# EAGLE design example (EAGLE 7.2.0)
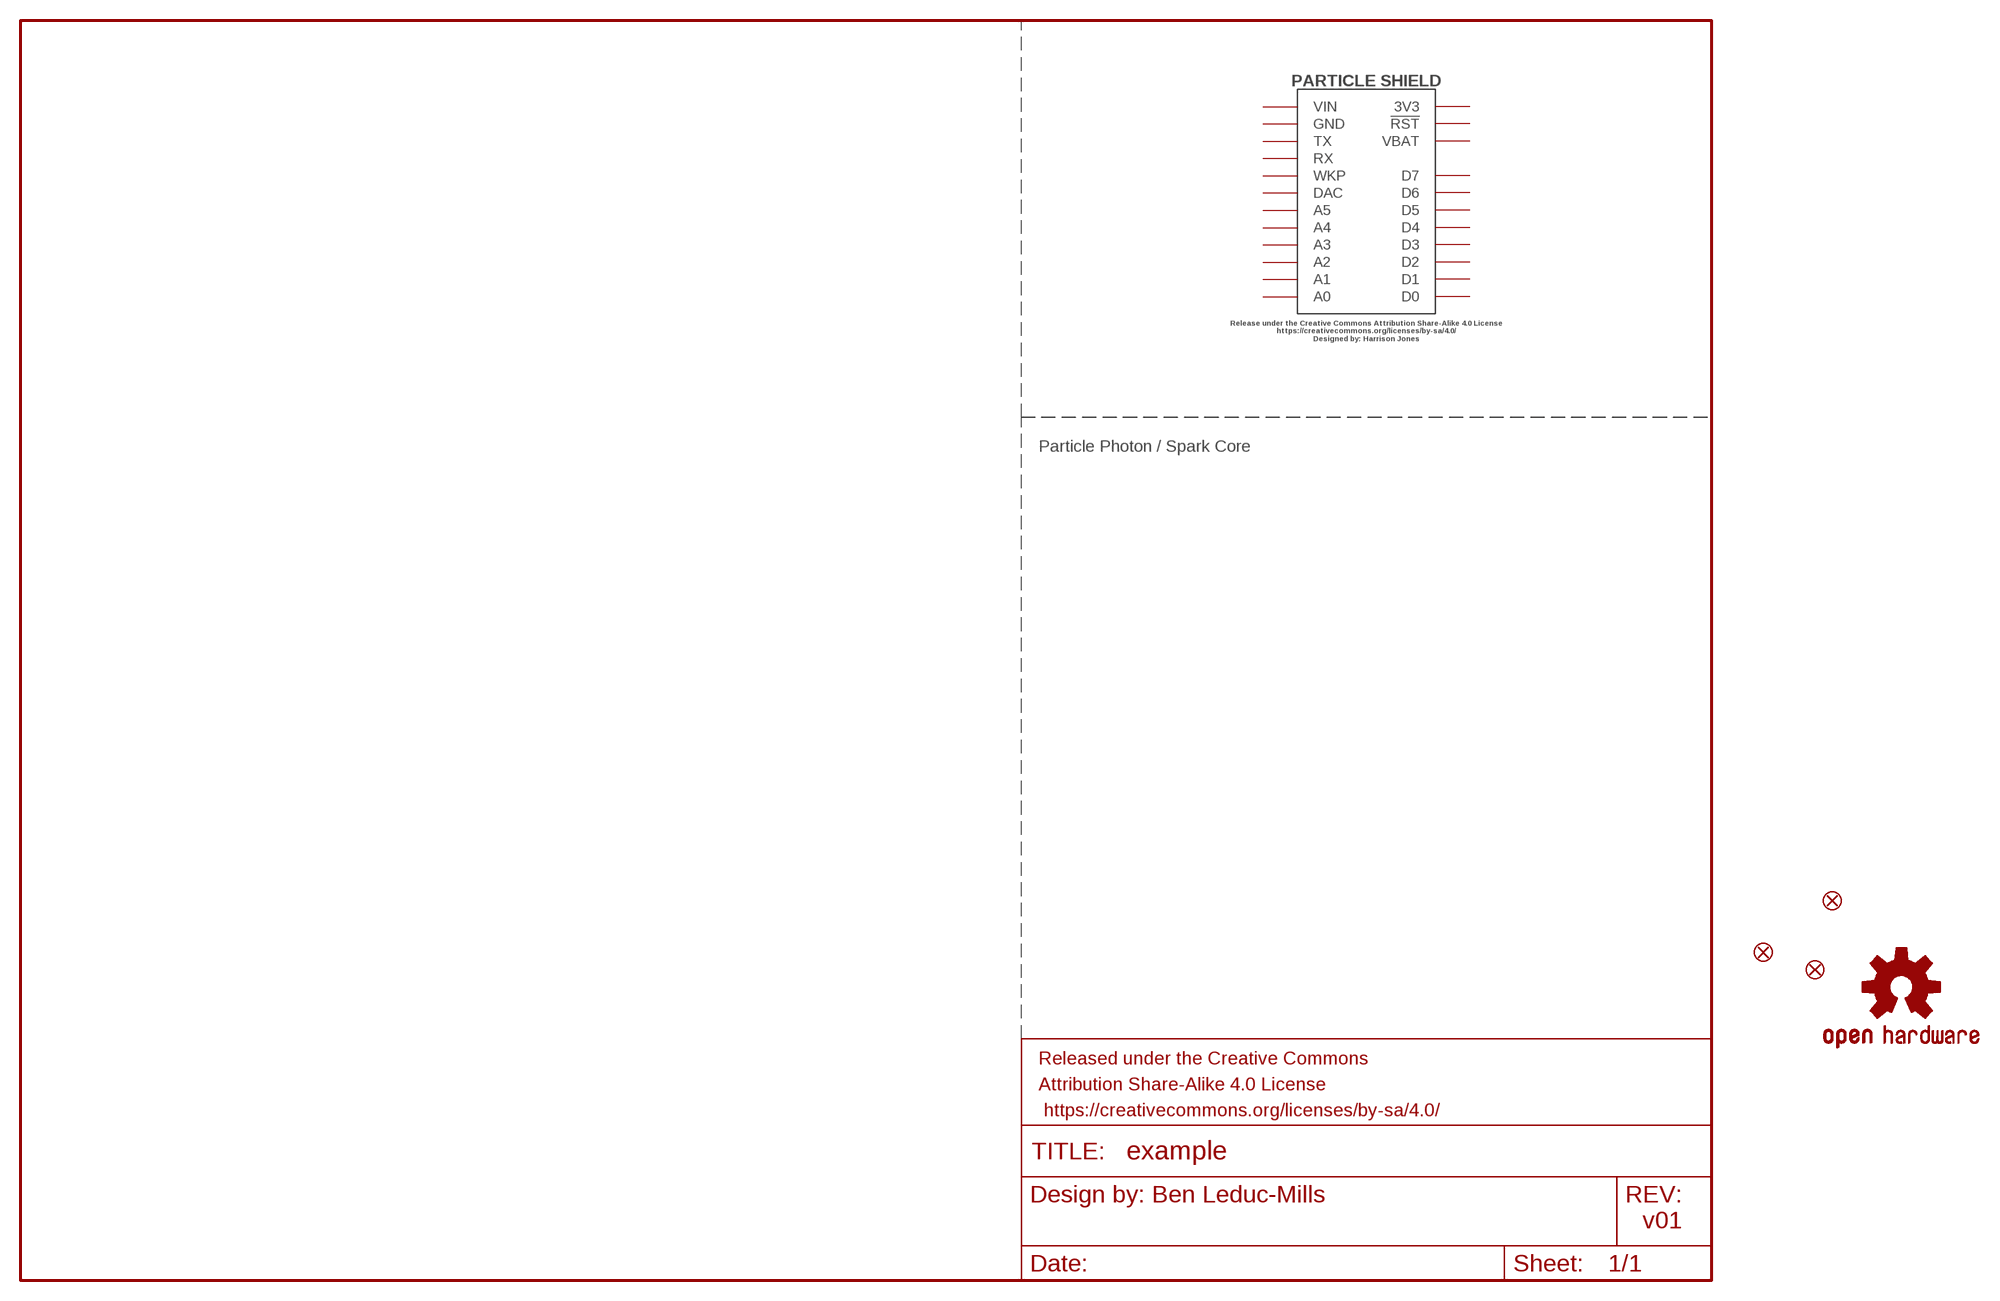
[diagram p0: schematic, sheet 1]

## Parts
FID1  FIDUCIAL1X2  [FIDUCIAL-1X2]
FID2  FIDUCIAL1X2  [FIDUCIAL-1X2]
FID3  FIDUCIAL1X2  [FIDUCIAL-1X2]
FRAME1  FRAME-LETTER  [CREATIVE_COMMONS]
LOGO2  OSHW-LOGOS  [OSHW-LOGO-S]
U$2  PARTICLE_SHIELD  [PARTICLE_SHIELD]
Unconnected: U$2.!RST_INNER(!RST) U$2.!RST_OUTER(!RST) U$2.A0_INNER(A0) U$2.A0_OUTER(A0) U$2.A1_INNER(A1) U$2.A1_OUTER(A1) U$2.A2_INNER(A2) U$2.A2_OUTER(A2) U$2.A3_INNER(A3) U$2.A3_OUTER(A3) U$2.A4_INNER(A4) U$2.A4_OUTER(A4) U$2.A5_INNER(A5) U$2.A5_OUTER(A5) U$2.D0_INNER(D0) U$2.D0_OUTER(D0) U$2.D1_INNER(D1) U$2.D1_OUTER(D1) U$2.D2_INNER(D2) U$2.D2_OUTER(D2) U$2.D3_INNER(D3) U$2.D3_OUTER(D3) U$2.D4_INNER(D4) U$2.D4_OUTER(D4) U$2.D5_INNER(D5) U$2.D5_OUTER(D5) U$2.D6_INNER(D6) U$2.D6_OUTER(D6) U$2.D7_INNER(D7) U$2.D7_OUTER(D7) U$2.DAC_INNER(DAC) U$2.DAC_OUTER(DAC) U$2.RX_INNER(RX) U$2.RX_OUTER(RX) U$2.TX_INNER(TX) U$2.TX_OUTER(TX) U$2.WKP_INNER(WKP) U$2.WKP_OUTER(WKP)

## Notes on the sheet
- Particle Photon / Spark Core
- v01

## Power pins joined to a net without a drawn wire
3V3: U$2.3V3_INNER(3V3) U$2.3V3_OUTER(3V3)
GND: U$2.GND_1_INNER(GND) U$2.GND_1_OUTER(GND) U$2.GND_2_INNER(GND) U$2.GND_2_OUTER(GND)
VBAT: U$2.VBAT_INNER(VBAT) U$2.VBAT_OUTER(VBAT)
VIN: U$2.VIN_INNER(VIN) U$2.VIN_OUTER(VIN)

## Library data of the parts
FID1-FID3 = SparkFun-Aesthetics:FIDUCIAL: Fiducial Alignment Points Various fiducial points for machine vision alignment.
FRAME1 = SparkFun-Aesthetics:FRAME-LETTER: Schematic Frame Standard 8.5x11 US Letter frame
LOGO2 = SparkFun-Aesthetics:OSHW-LOGO: Open Source Hardware Logo This logo indicates the piece of hardware it is found on incorporates a OSHW license and/or adheres to the definition of open source hardware found here: http://freedomdefined.org/OSHW
U$2 = Particle-Shield-Lib:PARTICLE_SHIELD

## Board
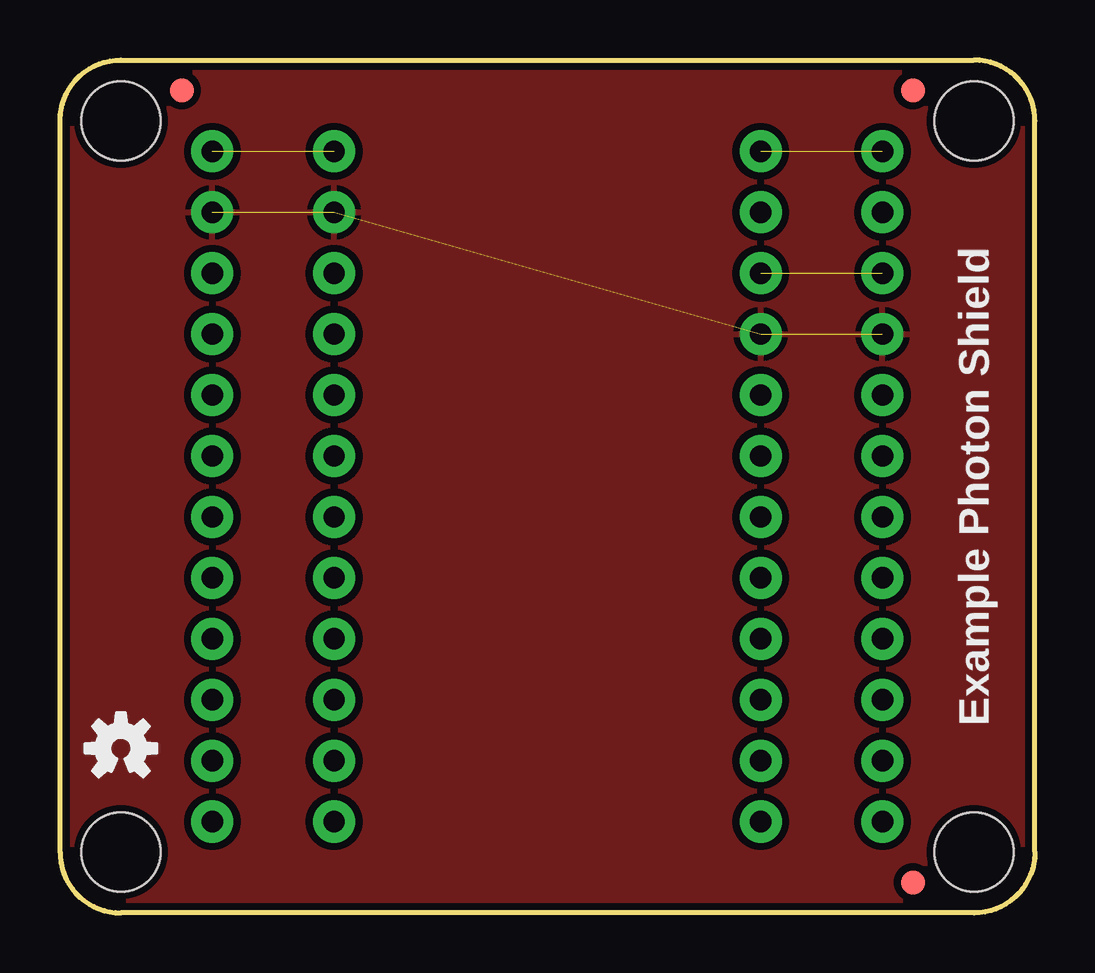
[diagram p1: board, top side]
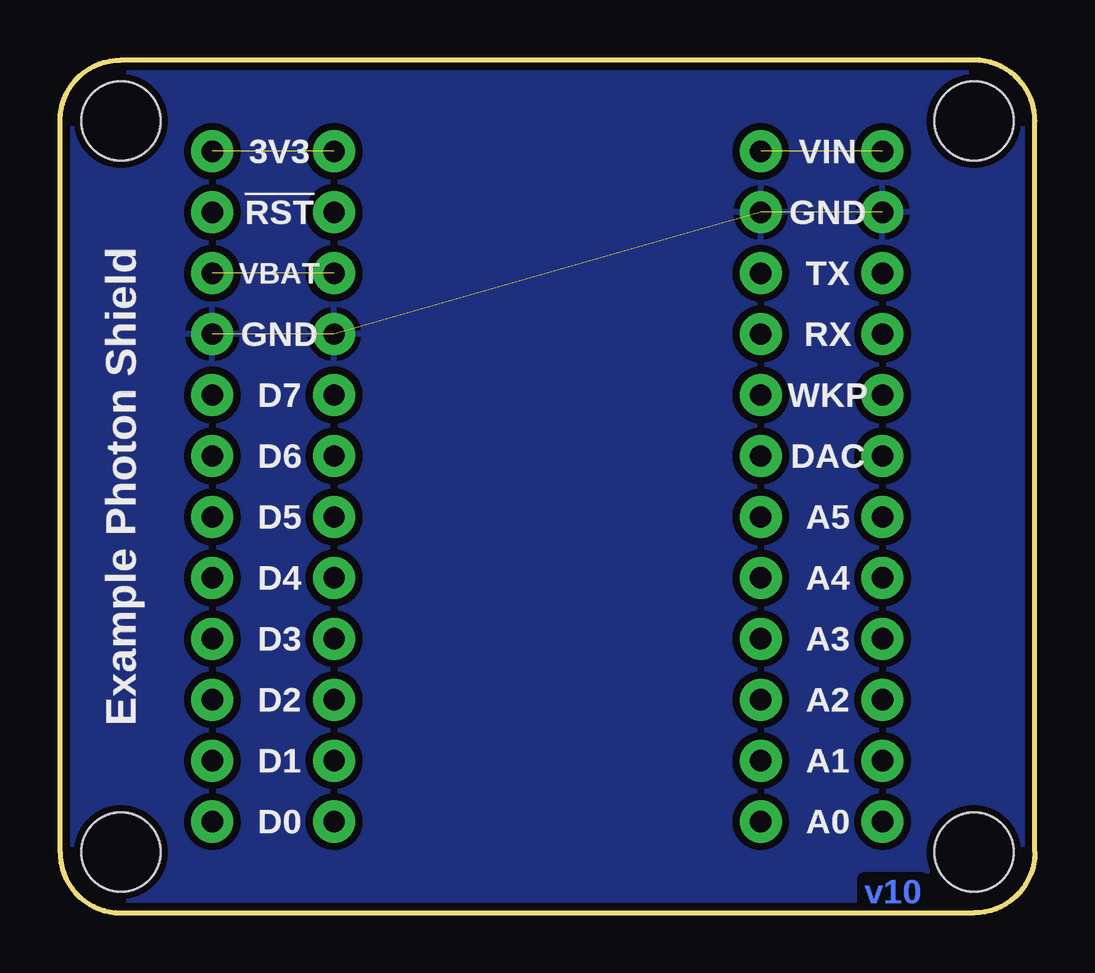
[diagram p2: board, bottom side, seen from below]

Size 40.64 x 35.56 mm. Coordinates in mm from the lower left corner, seen from the top.
Outline: 2.54,35.56 38.1,35.56 arc-90 40.64,33.02 40.64,2.54 arc-90 38.1,0 2.54,0 arc-90 0,2.54 0,33.02 arc-90 2.54,35.56
Copper layers (1*16): Top 0.035mm / dielectric 1.5mm / Bottom 0.035mm
Design rules "SparkFun-2-layer": minimum track width 7mil, minimum drill 15mil, track to track 8mil, track to pad 8mil, pad to pad 8mil, via to via 8mil, smd to smd 8mil, copper to edge 8mil, drill to drill 8mil, minimum pad ring 12mil, minimum via ring 10mil, stop-mask expansion 4mil, vias tented up to drill 20mil, thermal gap 10mil

### Footprints (pad centres in the part's own frame; a part is rotated, then mirrored left to right if it is on the bottom)
FIDUCIAL-1X2 = smd 1 x 1: 1 0,0
PARTICLE_SHIELD = drill 0.889 pad 1.753: 3V3_INNER 29.21,31.75; 3V3_OUTER 34.29,31.75; !RST_INNER 29.21,29.21; !RST_OUTER 34.29,29.21; A0_INNER 11.43,3.81; A0_OUTER 6.35,3.81; A1_INNER 11.43,6.35; A1_OUTER 6.35,6.35; A2_INNER 11.43,8.89; A2_OUTER 6.35,8.89; A3_INNER 11.43,11.43; A3_OUTER 6.35,11.43; A4_INNER 11.43,13.97; A4_OUTER 6.35,13.97; A5_INNER 11.43,16.51; A5_OUTER 6.35,16.51; D0_INNER 29.21,3.81; D0_OUTER 34.29,3.81; D1_INNER 29.21,6.35; D1_OUTER 34.29,6.35; D2_INNER 29.21,8.89; D2_OUTER 34.29,8.89; D3_INNER 29.21,11.43; D3_OUTER 34.29,11.43; D4_INNER 29.21,13.97; D4_OUTER 34.29,13.97; D5_INNER 29.21,16.51; D5_OUTER 34.29,16.51; D6_INNER 29.21,19.05; D6_OUTER 34.29,19.05; D7_INNER 29.21,21.59; D7_OUTER 34.29,21.59; DAC_INNER 11.43,19.05; DAC_OUTER 6.35,19.05; GND_1_INNER 11.43,29.21; GND_1_OUTER 6.35,29.21; GND_2_INNER 29.21,24.13; GND_2_OUTER 34.29,24.13; RX_INNER 11.43,24.13; RX_OUTER 6.35,24.13; TX_INNER 11.43,26.67; TX_OUTER 6.35,26.67; VBAT_INNER 29.21,26.67; VBAT_OUTER 34.29,26.67; VIN_INNER 11.43,31.75; VIN_OUTER 6.35,31.75; WKP_INNER 11.43,21.59; WKP_OUTER 6.35,21.59 | hole 3.3: 2.54,2.54; 2.54,33.02; 38.1,33.02; 38.1,2.54

### Placement (x,y rotation side)
FID1  5.08,34.29 0 top
FID2  35.56,1.27 0 top
FID3  35.56,34.29 0 top
FRAME1  -17.78,-20.32 0 top  (outside the outline)
LOGO2  2.54,6.86 0 top
U$2  0,0 0 top

### Tracks (layer width: path | path; a pad name or v marks a point on that pad's centre or on a via)
3V3  (1 unrouted)
GND  (3 unrouted)
  pour Top (isolate 0.305): 0,0 40.64,0 40.64,35.56 0,35.56
  pour Bottom (isolate 0.305): 0,0 40.64,0 40.64,35.56 0,35.56
VBAT  (1 unrouted)
VIN  (1 unrouted)

### Text on the board
Bottom: v10
tPlace: Example Photon Shield
bPlace: VIN | 3V3 | GND | !RST | TX | VBAT | RX | GND | WKP | D7 | DAC | D6 | Example Photon Shield | A5 | D5 | A4 | D4 | A3 | D3 | A2 | D2 | A1 | D1 | A0 | D0
Measures: Units in Inches
Reference: 10cm x 10cm | 5cm x 5cm
tDocu: Harrison Jones